# Altium schematic sheet I2C.SchDoc
size 199 x 200 mm; SheetNumber: 12; SheetTotal: 13
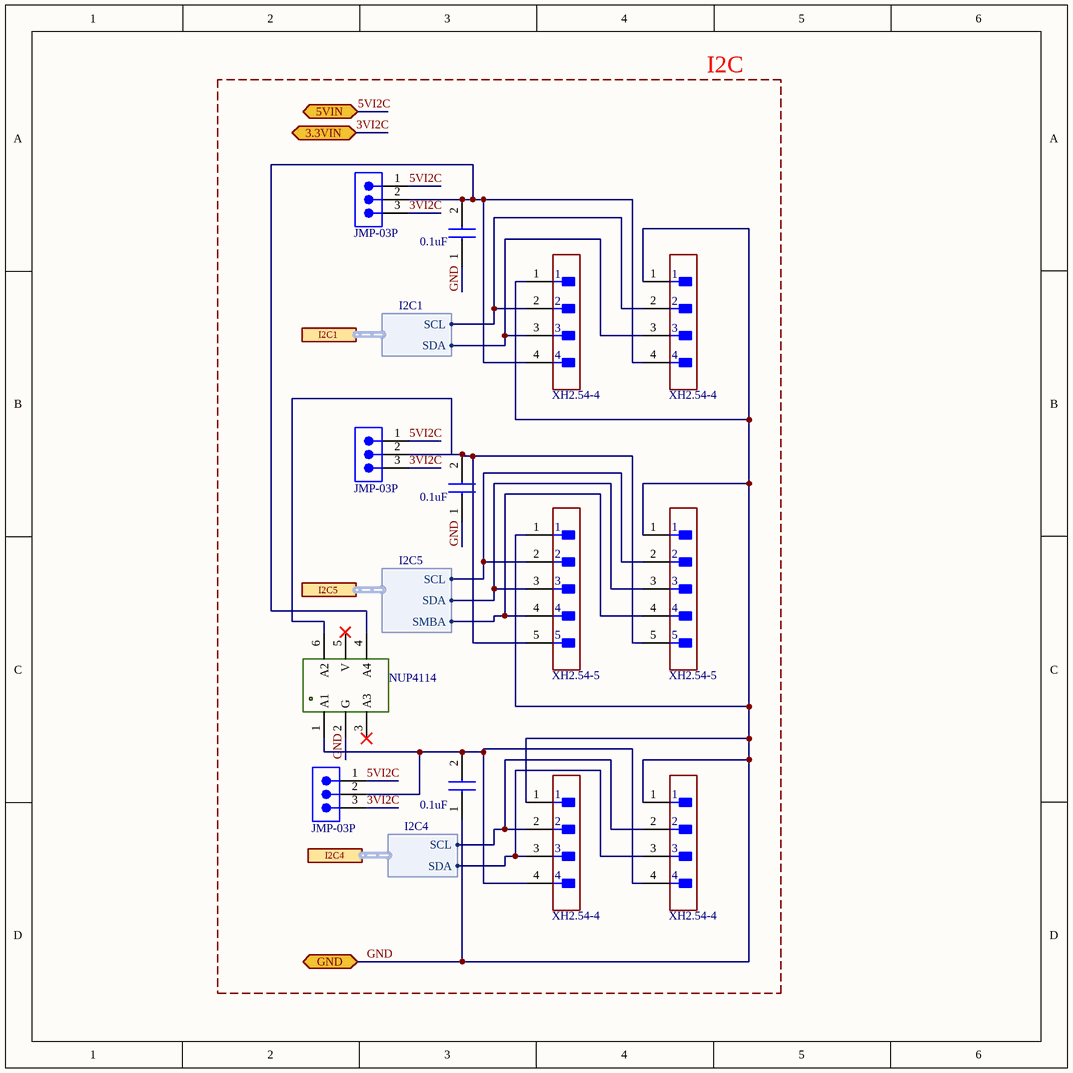
[diagram p0: I2C.SchDoc]

## Parts
CAPI2C1  0.1uF  [CAP0805]
CAPI2C4  0.1uF  [CAP0805]
CAPI2C5  0.1uF  [CAP0805]
ESDI2C  NUP4114  [NUP4114]
I2C1-2  XH2.54-4  [XH2.54-4]
I2C4-1  XH2.54-4  [XH2.54-4]
I2C4-2  XH2.54-4  [XH2.54-4]
I2C5-1  XH2.54-5  [XH2.54-5]
I2C5-2  XH2.54-5  [XH2.54-5]
I2С1-1  XH2.54-4  [XH2.54-4]
JMPI2C1  JMP-03P  [JMP-03P]
JMPI2C4  JMP-03P  [JMP-03P]
JMPI2C5  JMP-03P  [JMP-03P]

## Blocks framed on the sheet
I2C: CAPI2C1 CAPI2C4 CAPI2C5 ESDI2C I2C1-2 I2C4-1 I2C4-2 I2C5-1 I2C5-2 I2С1-1 JMPI2C1 JMPI2C4 JMPI2C5

## Ports
3.3VIN (bidir, see CONTROL_PCB_MAIN[4C], ADC1[2B], I_O[1A], MOTORS[2B], RELAY_5V_3.3V_LEVEL[3B], SPI[1A], UARTSTM[2A]), 5VIN (bidir, see CONTROL_PCB_MAIN[4C], ADC1[2B], I_O[1A], LEDS[1A], MOTORS[2B], RELAY_5V_3.3V_LEVEL[3B], SPI[1A], UARTSTM[2A]), GND (bidir, see CONTROL_PCB_MAIN[4C], ADC1[2D], CAN[2C], I_O[1C], LEDS[1D], MOTORS[2D], RELAY_5V_3.3V_LEVEL[5C], RELAY_12VV_VDD_LEVEL[5B], SPI[1D], STM32[1D], UARTSTM[2D]), I2C1 (harness I2C1, see CONTROL_PCB_MAIN[4C], STM32[2B]), I2C4 (harness I2C4, see CONTROL_PCB_MAIN[4C], STM32[2B]), I2C5 (harness I2C5, see CONTROL_PCB_MAIN[4C], STM32[2B])

## Harnesses
I2C4: SDA, SCL
I2C5: SDA, SCL, SMBA
I2C1: SDA, SCL

## Nets
3VI2C: JMPI2C1.3 JMPI2C4.3 JMPI2C5.3 ; port 3.3VIN
5VI2C: JMPI2C1.1 JMPI2C4.1 JMPI2C5.1 ; port 5VIN
GND: CAPI2C1.1 CAPI2C4.1 CAPI2C5.1 ESDI2C.2(G) I2C1-2.1 I2C4-1.1 I2C4-2.1 I2C5-1.1 I2C5-2.1 I2С1-1.1 ; port GND
NetCAPI2C1_2: CAPI2C1.2 ESDI2C.4(A4) I2C1-2.4 I2С1-1.4 JMPI2C1.2
NetCAPI2C4_2: CAPI2C4.2 ESDI2C.1(A1) I2C4-1.4 I2C4-2.4 JMPI2C4.2
NetCAPI2C5_2: CAPI2C5.2 ESDI2C.6(A2) I2C5-1.5 I2C5-2.5 JMPI2C5.2
NetI2C1-2_2: I2C1-2.2 I2С1-1.2 ; port I2C1.SCL
NetI2C1-2_3: I2C1-2.3 I2С1-1.3 ; port I2C1.SDA
NetI2C4-1_2: I2C4-1.2 I2C4-2.2 ; port I2C4.SCL
NetI2C4-1_3: I2C4-1.3 I2C4-2.3 ; port I2C4.SDA
NetI2C5-1_2: I2C5-1.2 I2C5-2.2 ; port I2C5.SCL
NetI2C5-1_3: I2C5-1.3 I2C5-2.3 ; port I2C5.SDA
NetI2C5-1_4: I2C5-1.4 I2C5-2.4 ; port I2C5.SMBA

Not connected (* = marked no-connect by the designer): ESDI2C 3(A3)* 5(V)*

## Library data of the parts
CAPI2C1 CAPI2C4 CAPI2C5 = CAP0805: CAP-SMD0805
ESDI2C = NUP4114: NUP4114HMR6T1G
I2C1-2 I2C4-1 I2C4-2 I2С1-1 = XH2.54-4: JST XH2.54-4pin
I2C5-1 I2C5-2 = XH2.54-5: JST XH2.54-5pin
JMPI2C1 JMPI2C4 JMPI2C5 = JMP-03P: PLS-1x3